# EAGLE schematic ATtiny10 (EAGLE 6.5.0)
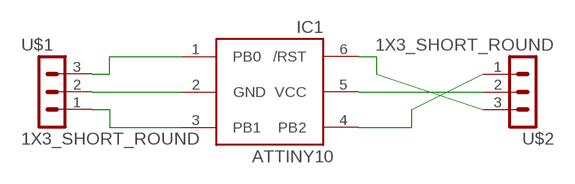
[diagram p0: schematic, sheet 1]

## Parts
IC1  ATTINY10  [SOT23-6]
U$1  1X3_SHORT_ROUND  [1X3_SHORT_ROUND]
U$2  1X3_SHORT_ROUND  [1X3_SHORT_ROUND]

## Nets
GND: IC1.2(GND) U$1.2
PB0: IC1.1(PB0) U$1.3
PB1: IC1.3(PB1) U$1.1
PB2: IC1.4(PB2) U$2.1
RST: IC1.6(/RST) U$2.3
VCC: IC1.5(VCC) U$2.2

## Library data of the parts
IC1 = adafruit:ATTINY10: ATtiny4/5/9/10 8-bit Microcontroller with 512/1024 Bytes In-System Programmable Flash
U$1 U$2 = Random parts(01-14-14):1X3_SHORT_ROUND